# Altium schematic sheet AUAV-X1_IOSOC_R1.SchDoc
size A4; PageSetup: Record=PageOptions|CenterHorizontal=True|CenterVertical=True|PrintScale=0.97|XCorrection=1.00|YCorrection=1.00|PrintKind=2|BorderSize=5000000|LeftOffset=0|BottomOffset=0|Orientation=2|PaperLength=1000|PaperWidth=1000|Scale=100|PaperSource=267|PrintQuality=-4|MediaType=1|DitherType=1|PaperKind=A4|PrintScaleMode=1
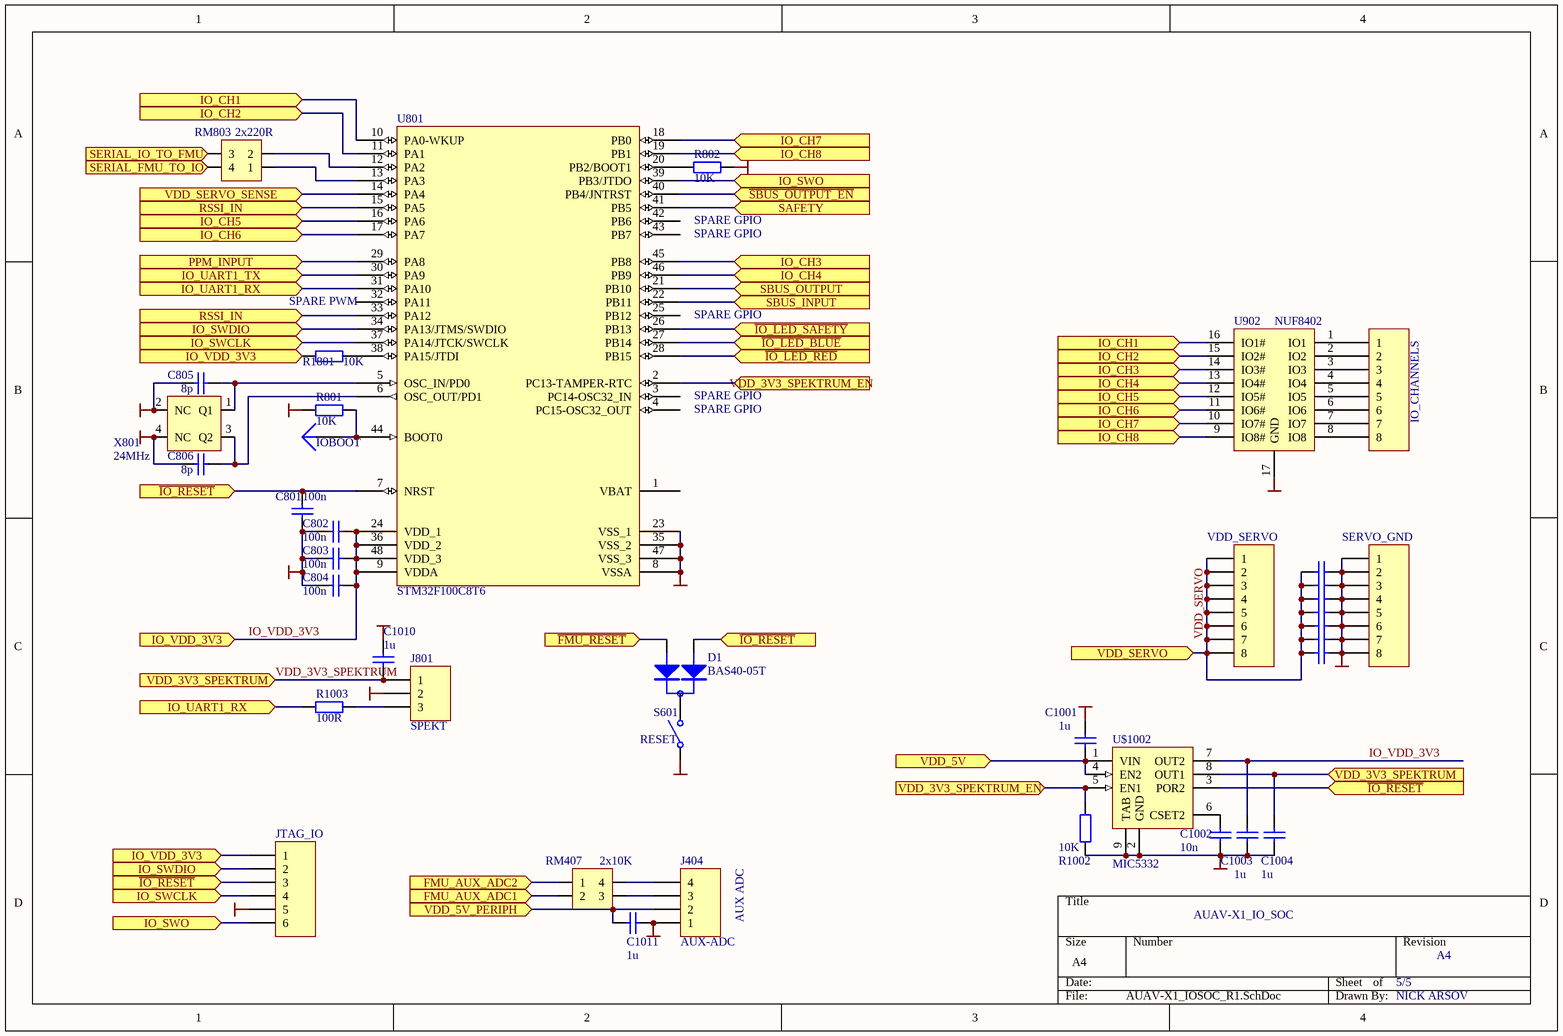
[diagram p0: AUAV-X1_IOSOC_R1.SchDoc]

## Parts
C801  100n  [0402A]
C802  100n  [0402A]
C803  100n  [0402A]
C804  100n  [0402A]
C805  8p  [0402A]
C806  8p  [0402A]
C1001  1u  [0402A]
C1002  10n  [0402A]
C1003  1u  [0402A]
C1004  1u  [0402A]
C1010  1u  [0402A]
C1011  1u  [0402A]
C3001  100n  [0402A]  (value not drawn)
C3002  100n  [0402A]  (value not drawn)
C3003  100n  [0402A]  (value not drawn)
C3004  100n  [0402A]  (value not drawn)
C3005  100n  [0402A]  (value not drawn)
C3006  100n  [0402A]  (value not drawn)
C3007  100n  [0402A]  (value not drawn)
D1  BAS40-05T  [SOT-523]
IO_CHANNELS  Header 8  [HDR1X8]  (value not drawn)
IOBOOT  Plug  [PAD1]  (value not drawn)
J404  AUX-ADC  [HDR1X4]
J801  SPEKT  [hdr1x3]
JTAG_IO  Header 6  [JTAG_TC2030]  (value not drawn)
R801  10K  [0402A]
R802  10K  [0402A]
R1002  10K  [0402A]
R1003  100R  [0402A]
R1801  10K  [0402A]
RM407  2x10K  [RM2_0804]
RM803  2x220R  [RM2_0804]
S601  RESET  [OMRON_B3U_V]
SERVO_GND  Header 8  [HDR1X8]  (value not drawn)
U801  STM32F100C8T6  [LQFP48_L]
U902  NUF8402  [NUF8402]
U$1002  MIC5332  [MIC5332]
VDD_SERVO  Header 8  [HDR1X8]  (value not drawn)
X801  24MHz  [Crystal_2.5x2]

## Ports
FMU_AUX_ADC1, FMU_AUX_ADC2, IO_CH1, IO_CH2, IO_CH3, IO_CH4, IO_CH5, IO_CH6, IO_CH7, IO_CH8, IO_SWCLK, IO_SWDIO, IO_SWO, IO_UART1_RX, IO_UART1_TX, IO_VDD_3V3, PPM_INPUT, RSSI_IN, SAFETY, SBUS_INPUT, SBUS_OUTPUT, SERIAL_FMU_TO_IO, SERIAL_IO_TO_FMU, VDD_3V3_SPEKTRUM, VDD_3V3_SPEKTRUM_EN, VDD_5V, VDD_5V_PERIPH, VDD_SERVO, VDD_SERVO_SENSE, ~{FMU_RESET}, ~{IO_LED_BLUE}, ~{IO_LED_RED}, ~{IO_LED_SAFETY}, ~{IO_RESET}, ~{SBUS_OUTPUT_EN}

## Nets
GND: C801.1 C802.1 C803.1 C804.1 C805.1 C806.1 C1001.2 C1002.1 C1003.1 C1004.1 C1010.2 C1011.2 C3001.1 C3002.1 C3003.1 C3004.1 C3005.1 C3006.1 C3007.1 J404.1 J801.2 JTAG_IO.5 R801.1 R802.2 R1002.1 S601.1(COMMON) SERVO_GND.1 SERVO_GND.2 SERVO_GND.3 SERVO_GND.4 SERVO_GND.5 SERVO_GND.6 SERVO_GND.7 SERVO_GND.8 U801.8(VSSA) U801.23(VSS_1) U801.35(VSS_2) U801.47(VSS_3) U902.17(GND) U$1002.2(GND) U$1002.9(TAB) X801.2(NC) X801.4(NC)
~{FMU_RESET}: D1.1 ; port ~{FMU_RESET}
~{IO_LED_BLUE}: U801.27(PB14) ; port ~{IO_LED_BLUE}
~{IO_LED_RED}: U801.28(PB15) ; port ~{IO_LED_RED}
~{IO_LED_SAFETY}: U801.26(PB13) ; port ~{IO_LED_SAFETY}
~{IO_RESET}: C801.2 D1.2 JTAG_IO.3 U801.7(NRST) U$1002.3(POR2) ; port ~{IO_RESET}
~{SBUS_OUTPUT_EN}: U801.40(PB4/JNTRST) ; port ~{SBUS_OUTPUT_EN}
FMU_AUX_ADC1: RM407.2 ; port FMU_AUX_ADC1
FMU_AUX_ADC2: RM407.1 ; port FMU_AUX_ADC2
IO_CH1: U801.10(PA0-WKUP) U902.16(IO1#) ; port IO_CH1
IO_CH2: U801.11(PA1) U902.15(IO2#) ; port IO_CH2
IO_CH3: U801.45(PB8) U902.14(IO3#) ; port IO_CH3
IO_CH4: U801.46(PB9) U902.13(IO4#) ; port IO_CH4
IO_CH5: U801.16(PA6) U902.12(IO5#) ; port IO_CH5
IO_CH6: U801.17(PA7) U902.11(IO6#) ; port IO_CH6
IO_CH7: U801.18(PB0) U902.10(IO7#) ; port IO_CH7
IO_CH8: U801.19(PB1) U902.9(IO8#) ; port IO_CH8
IO_SWCLK: JTAG_IO.4 U801.37(PA14/JTCK/SWCLK) ; port IO_SWCLK
IO_SWDIO: JTAG_IO.2 U801.34(PA13/JTMS/SWDIO) ; port IO_SWDIO
IO_SWO: JTAG_IO.6 U801.39(PB3/JTDO) ; port IO_SWO
IO_UART1_RX: R1003.2 U801.31(PA10) ; port IO_UART1_RX
IO_UART1_TX: U801.30(PA9) ; port IO_UART1_TX
IO_VDD_3V3: C802.2 C803.2 C804.2 C1003.2 JTAG_IO.1 R1801.1 U801.9(VDDA) U801.24(VDD_1) U801.36(VDD_2) U801.48(VDD_3) U$1002.7(OUT2) ; port IO_VDD_3V3
PPM_INPUT: U801.29(PA8) ; port PPM_INPUT
RSSI_IN: U801.15(PA5) U801.33(PA12) ; port RSSI_IN
SAFETY: U801.41(PB5) ; port SAFETY
SBUS_INPUT: U801.22(PB11) ; port SBUS_INPUT
SBUS_OUTPUT: U801.21(PB10) ; port SBUS_OUTPUT
SERIAL_FMU_TO_IO: RM803.4 ; port SERIAL_FMU_TO_IO
SERIAL_IO_TO_FMU: RM803.3 ; port SERIAL_IO_TO_FMU
VDD_3V3_SPEKTRUM: C1004.2 C1010.1 J801.1 U$1002.8(OUT1) ; port VDD_3V3_SPEKTRUM
VDD_3V3_SPEKTRUM_EN: R1002.2 U801.2(PC13-TAMPER-RTC) U$1002.5(EN1) ; port VDD_3V3_SPEKTRUM_EN
VDD_5V: C1001.1 U$1002.1(VIN) U$1002.4(EN2) ; port VDD_5V
VDD_5V_PERIPH: C1011.1 J404.2 ; port VDD_5V_PERIPH
VDD_SERVO: C3001.2 C3002.2 C3003.2 C3004.2 C3005.2 C3006.2 C3007.2 VDD_SERVO.1 VDD_SERVO.2 VDD_SERVO.3 VDD_SERVO.4 VDD_SERVO.5 VDD_SERVO.6 VDD_SERVO.7 VDD_SERVO.8 ; port VDD_SERVO
VDD_SERVO_SENSE: U801.14(PA4) ; port VDD_SERVO_SENSE
NetC805_2: C805.2 U801.5(OSC_IN/PD0) X801.1(Q1)
NetC806_2: C806.2 U801.6(OSC_OUT/PD1) X801.3(Q2)
NetC1002_2: C1002.2 U$1002.6(CSET2)
NetD1_3: D1.3 S601.2(NO)
NetIO_CHANNELS_1: IO_CHANNELS.1 U902.1(IO1)
NetIO_CHANNELS_2: IO_CHANNELS.2 U902.2(IO2)
NetIO_CHANNELS_3: IO_CHANNELS.3 U902.3(IO3)
NetIO_CHANNELS_4: IO_CHANNELS.4 U902.4(IO4)
NetIO_CHANNELS_5: IO_CHANNELS.5 U902.5(IO5)
NetIO_CHANNELS_6: IO_CHANNELS.6 U902.6(IO6)
NetIO_CHANNELS_7: IO_CHANNELS.7 U902.7(IO7)
NetIO_CHANNELS_8: IO_CHANNELS.8 U902.8(IO8)
NetIOBOOT_1: IOBOOT.1 R801.2 U801.44(BOOT0)
NetJ404_3: J404.3 RM407.3
NetJ404_4: J404.4 RM407.4
NetJ801_3: J801.3 R1003.1
NetR802_1: R802.1 U801.20(PB2/BOOT1)
NetR1801_2: R1801.2 U801.38(PA15/JTDI)
NetRM803_1: RM803.1 U801.13(PA3)
NetRM803_2: RM803.2 U801.12(PA2)

Not connected (* = marked no-connect by the designer): U801 1(VBAT) 3(PC14-OSC32_IN) 4(PC15-OSC32_OUT) 25(PB12) 32(PA11) 42(PB6) 43(PB7)

## Notes on the sheet
- SPARE GPIO
- SPARE PWM
- AUX ADC
- AUAV-X1_IO_SOC
- 5/5
- A4
- NICK ARSOV

## Library data of the parts
C801-C806 C1001-C1004 C1010 C1011 C3001-C3007 = Cap: Capacitor; Value: 100pF; Published: 8-Jun-2000; LatestRevisionDate: 17-Jul-2002; LatestRevisionNote: Re-released for DXP Platform.; PackageReference: RAD-0.3; Publisher: Altium Limited
D1 = D-DIODE
IO_CHANNELS SERVO_GND VDD_SERVO = Header 8: Header, 8-Pin; LatestRevisionDate: 17-Jul-2002; LatestRevisionNote: Re-released for DXP Platform.; Publisher: Altium Limited
J404 = Header 4: Header, 4-Pin; LatestRevisionDate: 17-Jul-2002; LatestRevisionNote: Re-released for DXP Platform.; Publisher: Altium Limited
J801 = Header 3: Header, 3-Pin; LatestRevisionDate: 17-Jul-2002; LatestRevisionNote: Re-released for DXP Platform.; Publisher: Altium Limited
JTAG_IO = Header 6: Header, 6-Pin; LatestRevisionDate: 17-Jul-2002; LatestRevisionNote: Re-released for DXP Platform.; Publisher: Altium Limited
R801 R802 R1002 R1003 R1801 = Res2: Resistor; Value: 1K; Published: 8-Jun-2000; LatestRevisionDate: 17-Jul-2002; LatestRevisionNote: Re-released for DXP Platform.; PackageReference: AXIAL-0.4; Publisher: Altium Limited
RM407 RM803 = RES_SMD_2
S601 = SW-SPST: Single-Pole, Single-Throw Switch; Published: 24-Mar-1999; LatestRevisionDate: 17-Jul-2002; LatestRevisionNote: Re-released for DXP Platform.; PackageReference: SPST-2; Publisher: Altium Limited
U801 = STM32F101C6T6: STM32 ARM-based 32-bit MCU with 32 Kbytes Flash, 48-pin LQFP, Industrial Temperature; Published: 30-May-2008; DatasheetVersion: rev6, Mar-2008; PackageVersion: Mar-2008; PackageReference: LQFP48; Publisher: Altium Limited; PackageDescription: 48-Pin Low-Profile Quad Flat Pack, 7 x 7 mm Body, 0.5 mm Pitch (LQFP48); ComponentLink1Description: Manufacturer Link; ComponentLink1URL: www.st.com/stm32; ComponentLink2Description: Datasheet; ComponentLink2URL: http://www.st.com/stonline/products/literature/ds/13586.pdf
X801 = Crystal_4pin
IOBOOT = Plug: LatestRevisionDate: 17-Jul-2002; LatestRevisionNote: Re-released for DXP Platform.; Publisher: Altium Limited